# EAGLE design nodemcuPowerSupply (EAGLE 9.6.2)
CNAME: Cybotians; CREVISION: v1.0.0
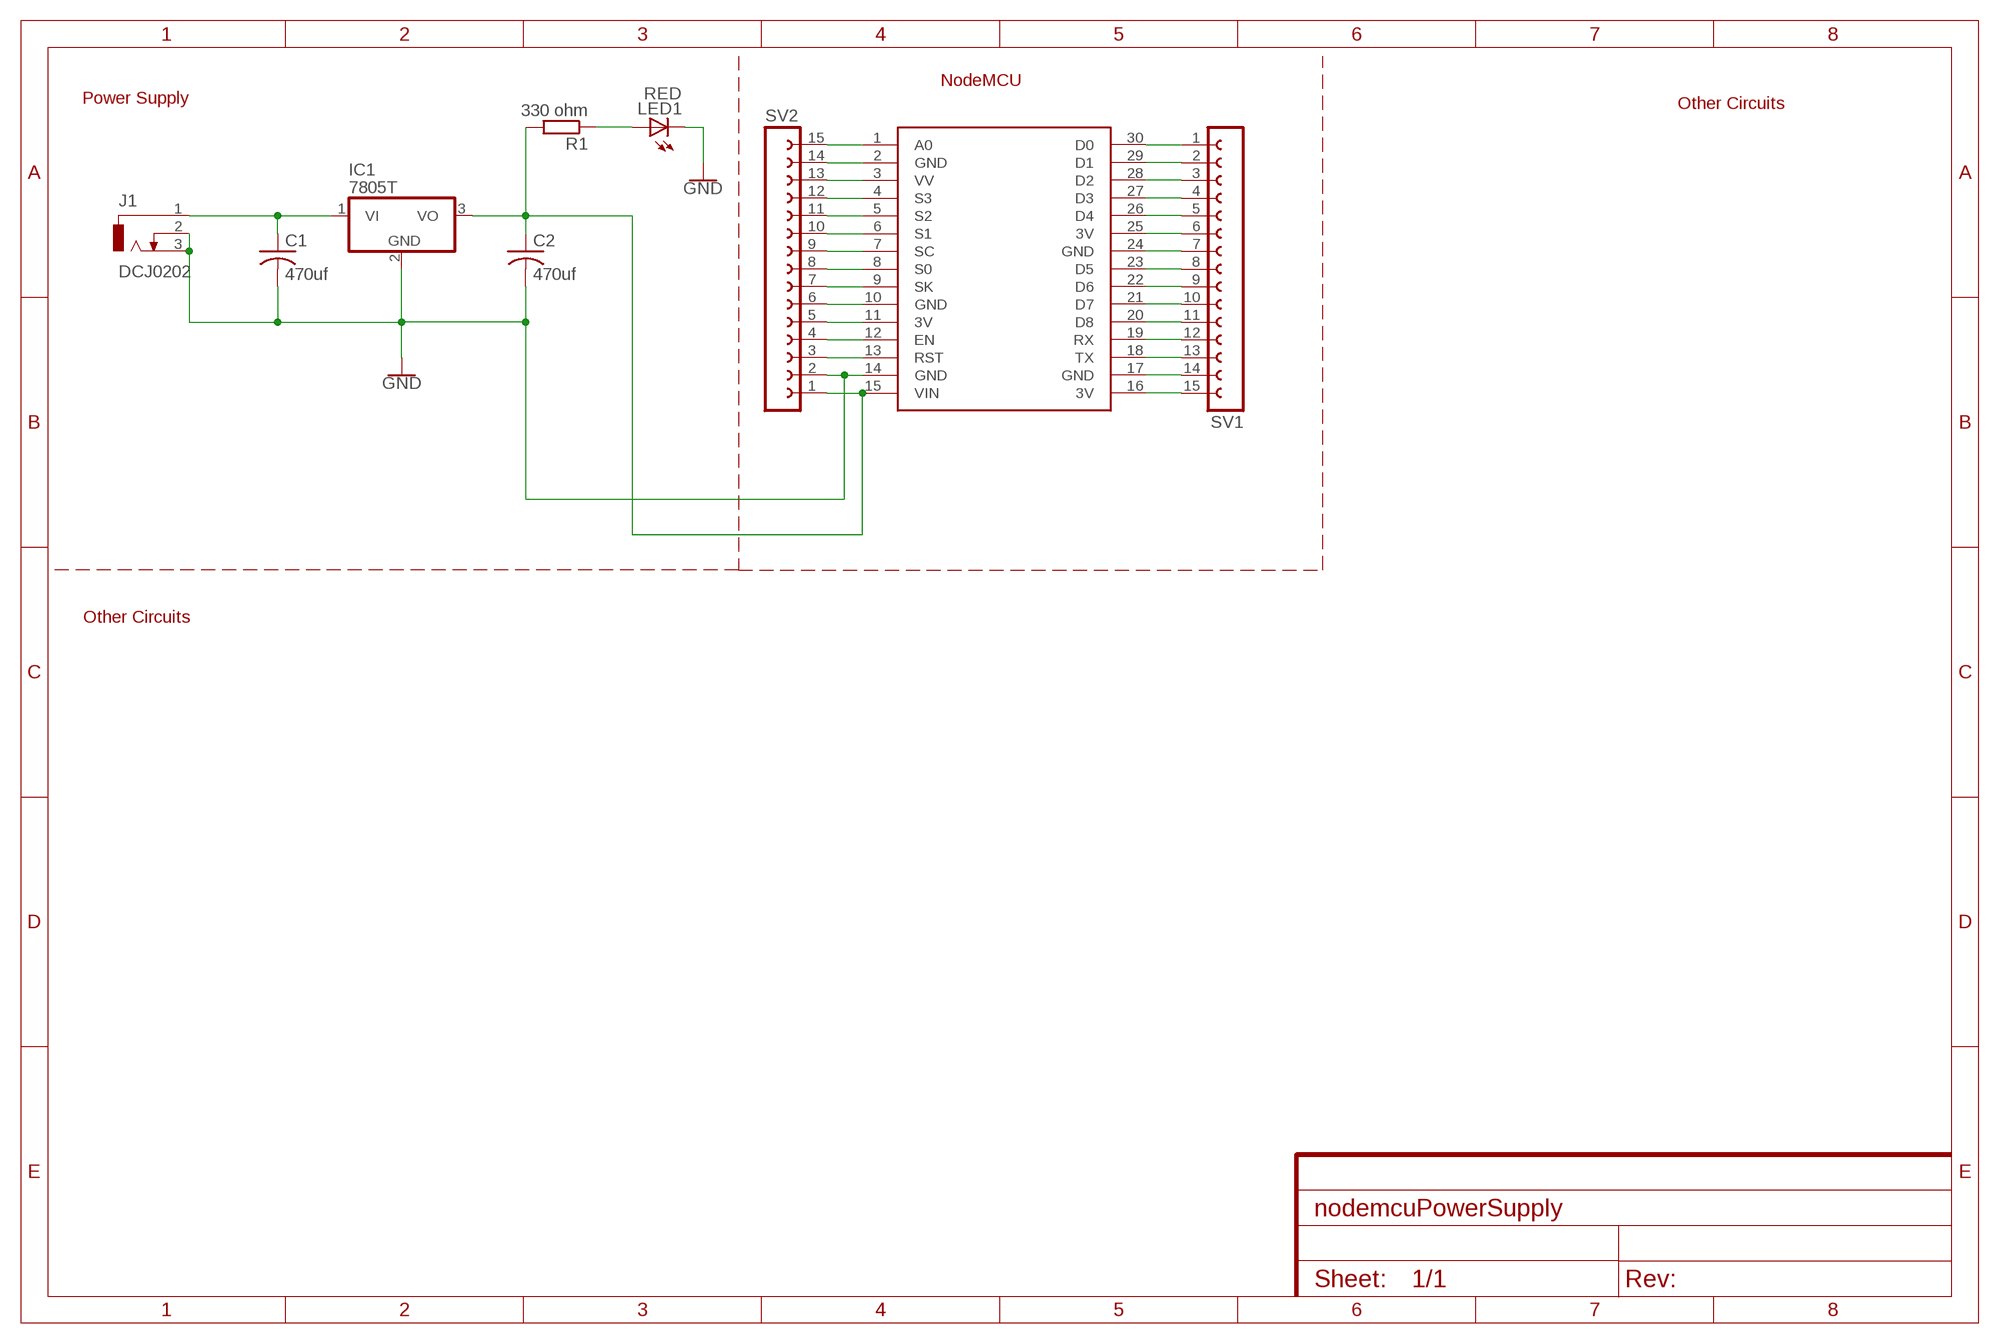
[diagram p0: schematic, sheet 1]

## Parts
C1  470uf  C-US025-024X044  [C025-024X044]
C2  470uf  C-US025-024X044  [C025-024X044]
IC1  7805T  [TO220H]
J1  DCJ0202  [DCJ0202]
LED1  RED  LED3MM  [LED3MM]
R1  330 ohm  R-EU_0204/5  [0204/5]
SV1  FE15-1  [FE15]
SV2  FE15-1  [FE15]
U$1  NODEMCU  [NODEMCU]

## Nets
GND: C1.2 C2.2 IC1.2(GND) J1.2 J1.3 LED1.K(C) SV2.2 U$1.14(GND)
N$1: SV2.15 U$1.1(A0)
N$2: SV2.14 U$1.2(GND)
N$3: SV2.13 U$1.3(VV)
N$4: SV2.12 U$1.4(S3)
N$5: SV2.11 U$1.5(S2)
N$6: SV2.10 U$1.6(S1)
N$7: SV2.9 U$1.7(SC)
N$8: SV2.8 U$1.8(S0)
N$9: SV2.7 U$1.9(SK)
N$10: SV2.6 U$1.10(GND)
N$11: SV2.5 U$1.11(3V)
N$12: SV2.4 U$1.12(EN)
N$13: SV2.3 U$1.13(RST)
N$14: LED1.A R1.1
N$16: SV1.1 U$1.30(D0)
N$17: SV1.2 U$1.29(D1)
N$18: SV1.3 U$1.28(D2)
N$19: SV1.4 U$1.27(D3)
N$20: SV1.5 U$1.26(D4)
N$21: SV1.6 U$1.25(3V)
N$22: SV1.7 U$1.24(GND)
N$23: SV1.8 U$1.23(D5)
N$24: SV1.9 U$1.22(D6)
N$25: SV1.10 U$1.21(D7)
N$26: SV1.11 U$1.20(D8)
N$27: SV1.12 U$1.19(RX)
N$28: SV1.13 U$1.18(TX)
N$29: SV1.14 U$1.17(GND)
N$30: SV1.15 U$1.16(3V)
N$31: C1.1 IC1.1(VI) J1.1
N$33: C2.1 IC1.3(VO) R1.2 SV2.1 U$1.15(VIN)

## Notes on the sheet
- NodeMCU
- Power Supply
- Other Circuits
- Other Circuits

## Library data of the parts
C1 C2 = rcl:C-US: CAPACITOR, American symbol; SPICEPREFIX: C
IC1 = adafruit:78*: Positive VOLTAGE REGULATOR Added bigger pads to the TO-92 package
J1 = con-jack:DCJ0202: DC POWER JACK Source: DCJ0202.pdf; OC_FARNELL: unknown; OC_NEWARK: unknown
LED1 = adafruit:LED: LED OSRAM: - CHIPLED LG R971, LG N971, LY N971, LG Q971, LY Q971, LO R971, LY R971 LH N974, LH R974 LS Q976, LO Q976, LY Q976 LO Q996 - Hyper CHIPLED LW Q18S LB Q993, LB Q99A, LB R99A - SideLED LS A670, LO A670, LY A670, LG A670, LP A670 LB A673, LV A673, LT A673, LW A673 LH A674 LY A675 LS A676, LA A676, LO A676, LY A676, LW A676 LS A679, LY A679, LG A679 - Hyper Micro SIDELED® LS Y876, LA Y876, LO Y876, LY Y876 LT Y87S - SmartLED LW L88C, LW L88S LB L89C, LB L89S, LG L890 LS L89K, LO L89K, LY L89K LS L896, LA L896, LO L896, LY L896 - TOPLED LS T670, LO T670, LY T670, LG T670, LP T670 LSG T670, LSP T670, LSY T670, LOP T670, LYG T670 LG T671, LOG T671, LSG T671 LB T673, LV T673, LT T673, LW T673 LH T674 LS T676, LA T676, LO T676, LY T676, LB T676, LH T676, LSB T676, LW T676 LB T67C, LV T67C, LT T67C, LS T67K, LO T67K, LY T67K, LW E67C LS E67B, LA E67B, LO E67B, LY E67B, LB E67C, LV E67C, LT E67C LW T67C LS T679, LY T679, LG T679 LS T770, LO T770, LY T770, LG T770, LP T770 LB T773, LV T773, LT T773, LW T773 LH T774 LS E675, LA E675, LY E675, LS T675 LS T776, LA T776, LO T776, LY T776, LB T776 LHGB T686 LT T68C, LB T68C - Hyper Mini TOPLED® LB M676 - Mini TOPLED Santana® LG M470 LS M47K, LO M47K, LY M47K Source: http://www.osram.convergy.de/
R1 = rcl:R-EU_: RESISTOR, European symbol; SPICEPREFIX: R
SV1 SV2 = con-lsta:FE15-1: FEMALE HEADER; OC_FARNELL: unknown; OC_NEWARK: unknown
U$1 = nodemcu:NODEMCU

## Board
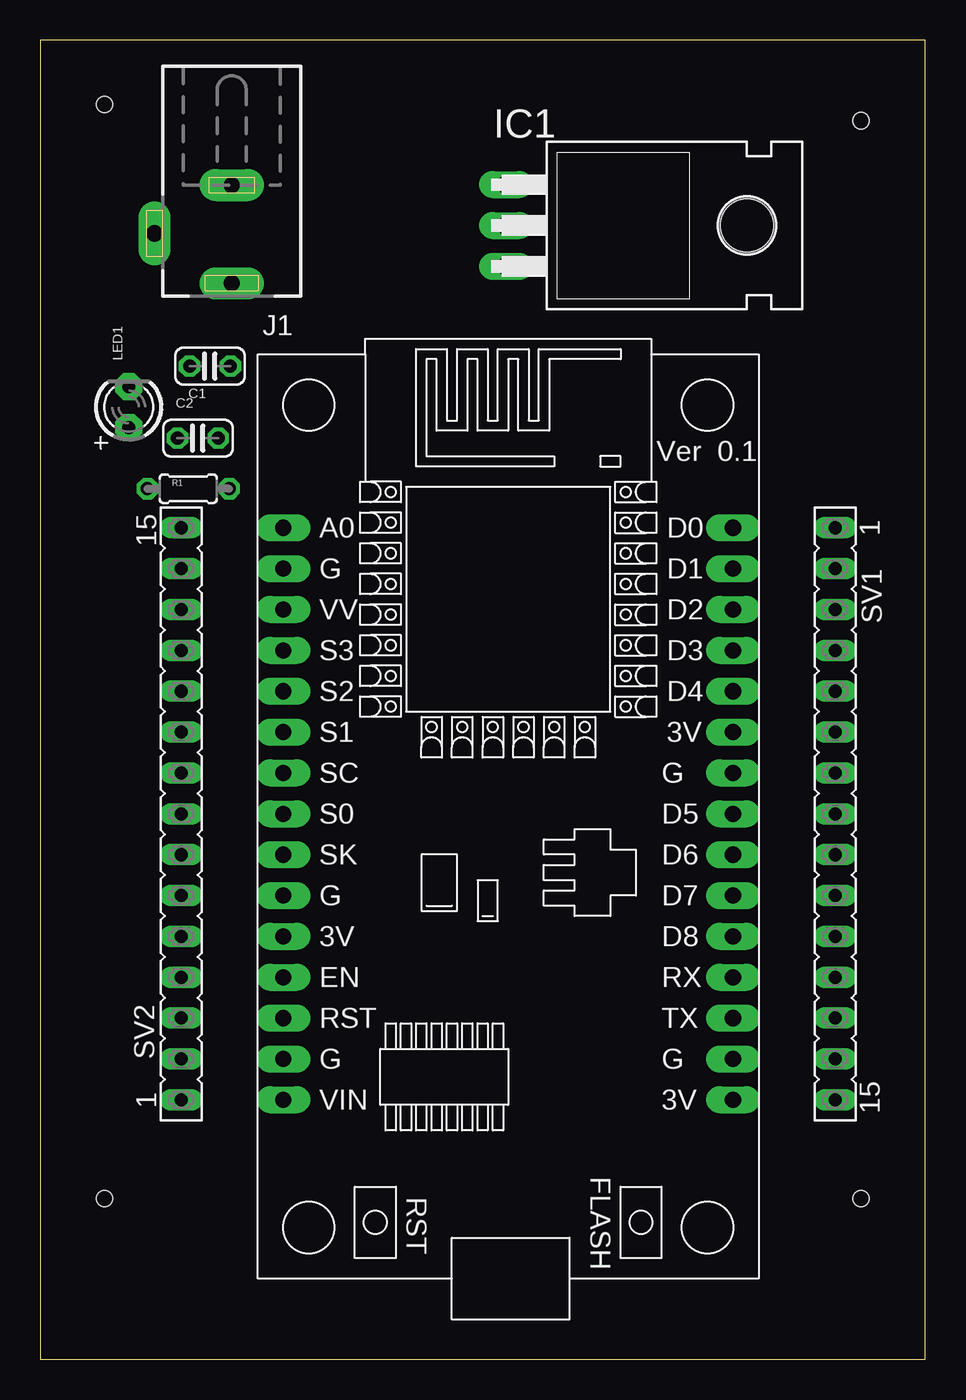
[diagram p1: board, top side]
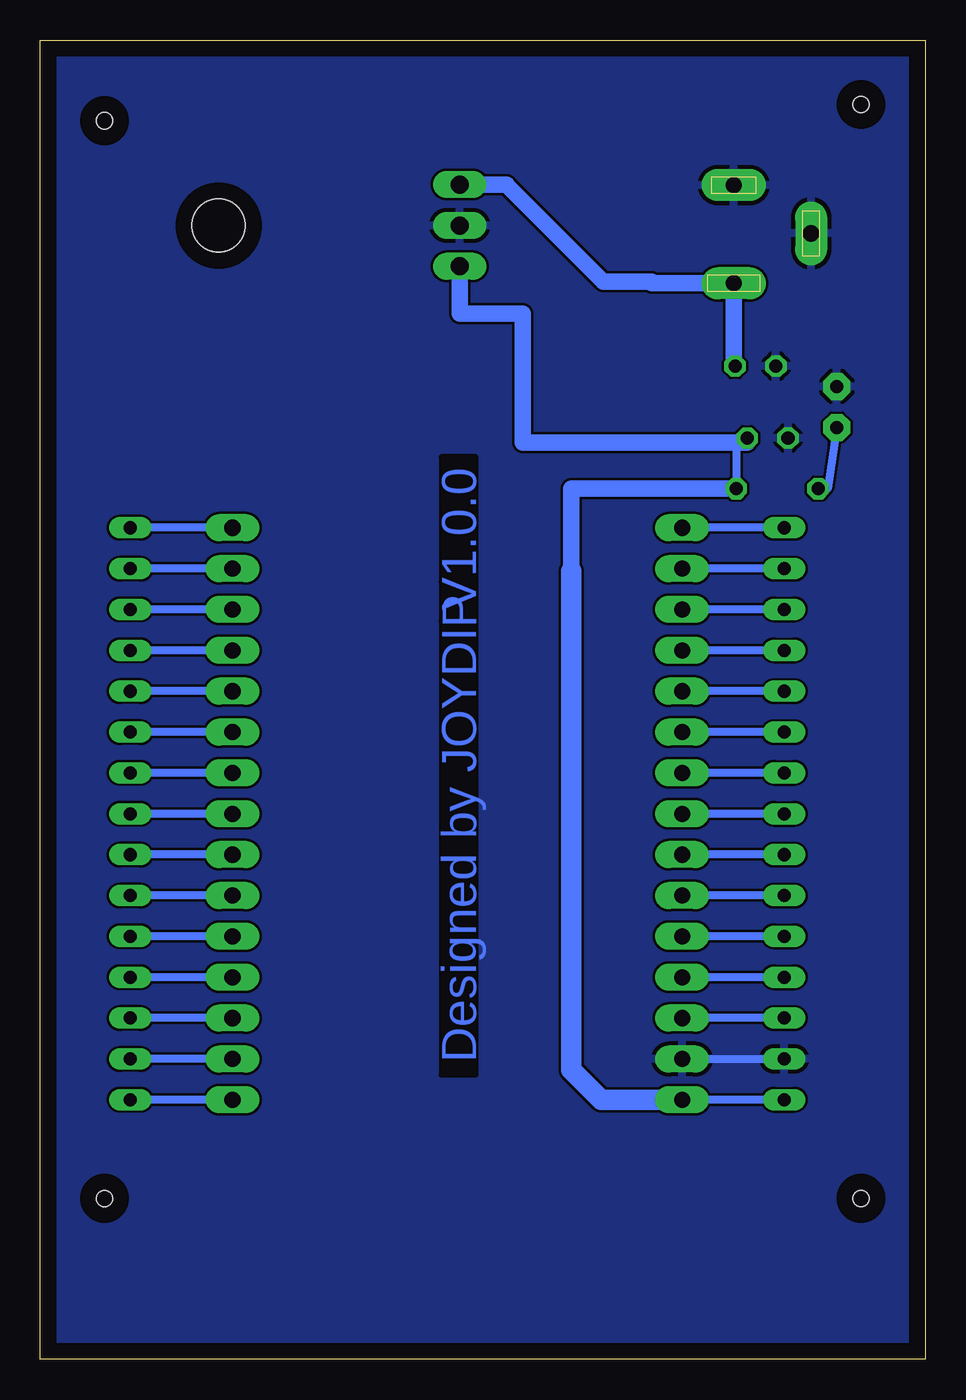
[diagram p2: board, bottom side, seen from below]

Size 55 x 82 mm. Coordinates in mm from the lower left corner, seen from the top.
Outline: 0,0 55,0 55,82 0,82 0,0
Copper layers (1*16): Top 0.035mm / dielectric 1.5mm / Bottom 0.035mm
Design rules "default": minimum track width 6mil, minimum drill 0.35mm, track to track 6mil, track to pad 6mil, pad to pad 6mil, via to via 6mil, smd to smd 6mil, copper to edge 40mil, drill to drill 6mil, minimum pad ring 10mil, minimum via ring 8mil, stop-mask expansion 4mil, vias tented up to drill 0mil, thermal gap 10mil
Holes 1 mm at 4,78 51,77 4,10 51,10

### Footprints (pad centres in the part's own frame; a part is rotated, then mirrored left to right if it is on the bottom)
C025-024X044 = drill 0.813 octagon: 1 -1.27,0; 2 1.27,0
TO220H = drill 1.118 long: 1 -2.54,-10.16; 2 0,-10.16; 3 2.54,-10.16 | hole 3.302: 0,4.826
DCJ0202 = drill 1 pad 2 long: 1 0,3.1; 2 4.8,0; 3 0,-3
LED3MM = drill 0.813 pad 1.676 octagon: A -1.27,0; K 1.27,0
0204/5 = drill 0.813 octagon: 1 -2.54,0; 2 2.54,0
FE15 = drill 0.813 long: 1 -17.78,0; 2 -15.24,0; 3 -12.7,0; 4 -10.16,0; 5 -7.62,0; 6 -5.08,0; 7 -2.54,0; 8 0,0; 9 2.54,0; 10 5.08,0; 11 7.62,0; 12 10.16,0; 13 12.7,0; 14 15.24,0; 15 17.78,0
NODEMCU = drill 1 pad 1.676 long: 1 -13.97,17.78; 2 -13.97,15.24; 3 -13.97,12.7; 4 -13.97,10.16; 5 -13.97,7.62; 6 -13.97,5.08; 7 -13.97,2.54; 8 -13.97,0; 9 -13.97,-2.54; 10 -13.97,-5.08; 11 -13.97,-7.62; 12 -13.97,-10.16; 13 -13.97,-12.7; 14 -13.97,-15.24; 15 -13.97,-17.78; 16 13.97,-17.78; 17 13.97,-15.24; 18 13.97,-12.7; 19 13.97,-10.16; 20 13.97,-7.62; 21 13.97,-5.08; 22 13.97,-2.54; 23 13.97,0; 24 13.97,2.54; 25 13.97,5.08; 26 13.97,7.62; 27 13.97,10.16; 28 13.97,12.7; 29 13.97,15.24; 30 13.97,17.78

### Placement (x,y rotation side)
C1  10.55,61.74 180 top
C2  9.8,57.26 180 top
IC1  39.09,70.48 270 top
J1  11.9,69.99 180 top
LED1  5.5,59.2 90 top
R1  9.2,54.12 0 top
SV1  49.4,33.91 270 top
SV2  8.76,33.91 90 top
U$1  29.08,33.91 0 top

### Tracks (layer width: path | path; a pad name or v marks a point on that pad's centre or on a via)
GND
  Bottom 0.508: U$1.14 SV2.2
  pour Bottom: 1,82 55,82 55,0 1,0
N$1
  Bottom 0.508: SV2.15 U$1.1
N$2
  Bottom 0.508: SV2.14 U$1.2
N$3
  Bottom 0.508: SV2.13 U$1.3
N$4
  Bottom 0.508: SV2.12 U$1.4
N$5
  Bottom 0.508: SV2.11 U$1.5
N$6
  Bottom 0.508: SV2.10 U$1.6
N$7
  Bottom 0.508: SV2.9 U$1.7
N$8
  Bottom 0.508: SV2.8 U$1.8
N$9
  Bottom 0.508: SV2.7 U$1.9
N$10
  Bottom 0.508: SV2.6 U$1.10
N$11
  Bottom 0.508: SV2.5 U$1.11
N$12
  Bottom 0.508: SV2.4 U$1.12
N$13
  Bottom 0.508: SV2.3 U$1.13
N$14
  Bottom 0.508: LED1.A 6.07,54.12 R1.1
N$16
  Bottom 0.508: U$1.30 SV1.1
N$17
  Bottom 0.508: U$1.29 SV1.2
N$18
  Bottom 0.508: U$1.28 SV1.3
N$19
  Bottom 0.508: U$1.27 SV1.4
N$20
  Bottom 0.508: U$1.26 SV1.5
N$21
  Bottom 0.508: U$1.25 SV1.6
N$22
  Bottom 0.508: U$1.24 SV1.7
N$23
  Bottom 0.508: U$1.23 SV1.8
N$24
  Bottom 0.508: U$1.22 SV1.9
N$25
  Bottom 0.508: U$1.21 SV1.10
N$26
  Bottom 0.508: U$1.20 SV1.11
N$27
  Bottom 0.508: U$1.19 SV1.12
N$28
  Bottom 0.508: U$1.18 SV1.13
N$29
  Bottom 0.508: U$1.17 SV1.14
N$30
  Bottom 0.508: U$1.16 SV1.15
N$31
  Bottom 1.016: C1.1 11.9,61.74 J1.1 17,66.89 17,67 20,67 26,73 26,73.02 IC1.1
N$33
  Bottom 0.406: C2.1 11.07,57 11.06,57
  Bottom 0.508: SV2.1 U$1.15 | C2.1 11.74,57.26 R1.2
  Bottom 1.016: R1.2 22,54.12 22,49 | IC1.3 28.93,65 25,65 25,57 11.06,57
  Bottom 1.27: U$1.15 20.13,16.13 22,18 22,49

### Text on the board
Bottom: V1.0.0 | Designed by JOYDIP